# Altium schematic sheet PIC32.SchDoc
size A
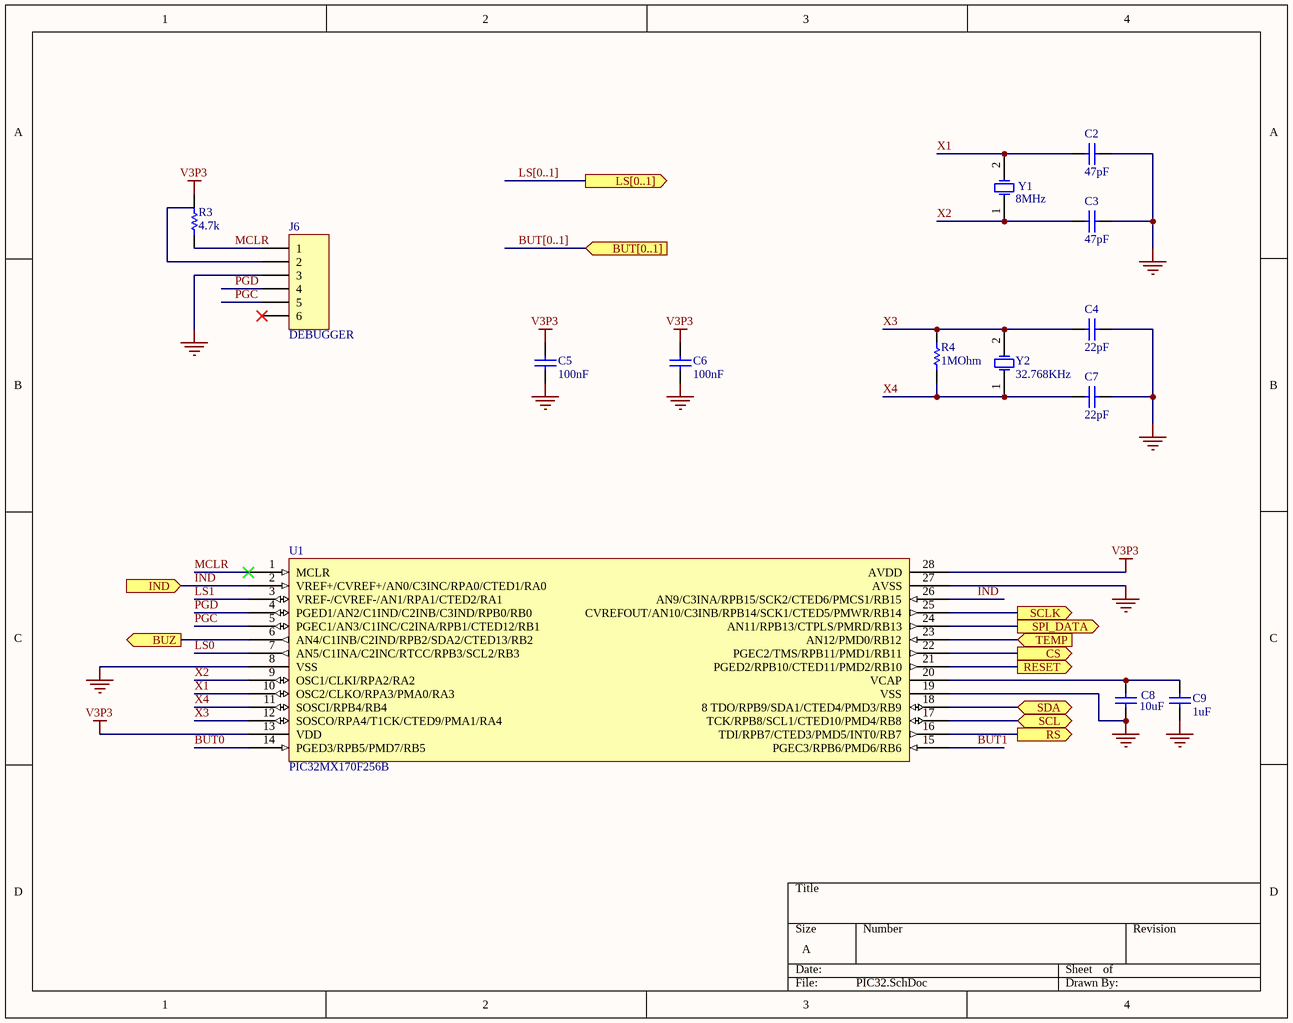
[diagram p0: PIC32.SchDoc]

## Parts
C2  47pF  [CAPACITOR]
C3  47pF  [CAPACITOR]
C4  22pF  [CAPACITOR]
C5  100nF  [CAPACITOR]
C6  100nF  [CAPACITOR]
C7  22pF  [CAPACITOR]
C8  10uF  [CAPACITOR]
C9  1uF  [CAPACITOR]
J6  DEBUGGER  [DEBUG]
R3  4.7k  [Resistor]
R4  1MOhm  [Resistor]
U1  PIC32MX170F256B  [PIC32]
Y1  8MHz  [OSC1]
Y2  32.768KHz  [OSC2]

## Ports
BUT[0..1] (in), BUZ (out), CS (out), IND (in), LS[0..1] (out), RESET (out), RS (out), SCL (bidir), SCLK (out), SDA (bidir), SPI_DATA (out), TEMP (in)

## Nets
GND: C2.2 C3.2 C4.2 C5.1 C6.1 C7.2 C8.1 C9.1 J6.3 U1.8(VSS) U1.19(VSS) U1.27(AVSS)
V3P3: C5.2 C6.2 R3.1 U1.13(VDD) U1.28(AVDD)
BUT0: U1.14(PGED3/RPB5/PMD7/RB5)
BUT1: U1.15(PGEC3/RPB6/PMD6/RB6)
BUZ: U1.6(AN4/C1INB/C2IND/RPB2/SDA2/CTED13/RB2) ; port BUZ
CS: U1.22(PGEC2/TMS/RPB11/PMD1/RB11) ; port CS
IND: U1.2(VREF+/CVREF+/AN0/C3INC/RPA0/CTED1/RA0) U1.26(AN9/C3INA/RPB15/SCK2/CTED6/PMCS1/RB15) ; port IND
LS0: U1.7(AN5/C1INA/C2INC/RTCC/RPB3/SCL2/RB3)
LS1: U1.3(VREF-/CVREF-/AN1/RPA1/CTED2/RA1)
MCLR: J6.1 R3.2 U1.1(MCLR)
PGC: J6.5 U1.5(PGEC1/AN3/C1INC/C2INA/RPB1/CTED12/RB1)
PGD: J6.4 U1.4(PGED1/AN2/C1IND/C2INB/C3IND/RPB0/RB0)
RESET: U1.21(PGED2/RPB10/CTED11/PMD2/RB10) ; port RESET
RS: U1.16(TDI/RPB7/CTED3/PMD5/INT0/RB7) ; port RS
SCL: U1.17(TCK/RPB8/SCL1/CTED10/PMD4/RB8) ; port SCL
SCLK: U1.25(CVREFOUT/AN10/C3INB/RPB14/SCK1/CTED5/PMWR/RB14) ; port SCLK
SDA: U1.18(8_TDO/RPB9/SDA1/CTED4/PMD3/RB9) ; port SDA
SPI_DATA: U1.24(AN11/RPB13/CTPLS/PMRD/RB13) ; port SPI_DATA
TEMP: U1.23(AN12/PMD0/RB12) ; port TEMP
X1: C2.1 U1.10(OSC2/CLKO/RPA3/PMA0/RA3) Y1.2(OSC2)
X2: C3.1 U1.9(OSC1/CLKI/RPA2/RA2) Y1.1(OSC1)
X3: C4.1 R4.1 U1.12(SOSCO/RPA4/T1CK/CTED9/PMA1/RA4) Y2.2(OSC2)
X4: C7.1 R4.2 U1.11(SOSCI/RPB4/RB4) Y2.1(OSC1)
NetC8_2: C8.2 C9.2 U1.20(VCAP)

Not connected (* = marked no-connect by the designer): J6 2 6*

## Buses and harness runs
bus BUT[0..1] = port BUT[0..1]
bus LS[0..1] = port LS[0..1]

## Library data of the parts
C2-C9 = Cap: Capacitor; Published: 8-Jun-2000; LatestRevisionDate: 17-Jul-2002; LatestRevisionNote: Re-released for DXP Platform.; PackageReference: RAD-0.3; Publisher: Altium Limited; PackageDescription: Radial Cap, Thru-Hole; 2 Leads; 0.3 in Pin Spacing
J6 = Header 6: DEB Connector; Ref. Fournisseur: 9731172; Fabricant: Molex; Fournisseur: Farnell; LatestRevisionDate: 17-Jul-2002; LatestRevisionNote: Re-released for DXP Platform.; Publisher: Altium Limited; Ref. Fabricant: 22-27-2061
R3 R4 = Res1: Resistor; Published: 8-Jun-2000; LatestRevisionDate: 17-Jul-2002; LatestRevisionNote: Re-released for DXP Platform.; PackageReference: AXIAL-0.3; Publisher: Altium Limited; PackageDescription: Axial Device, Thru-Hole; 2 Leads; 0.3 in Pin Spacing
  R3: Value: 4.7k
  R4: Value: 1MOhm
U1 = PIC32MX170F256B: PIC32; Fabricant: MICROCHIP; Ref. Fabricant: PIC32MX170F256B-I/SO; Fournisseur: Farnell; Ref. Fournisseur: 2449077
Y1 = XTAL: Crystal Oscillator; Fabricant: IQD FREQUENCY PRODUCTS; Fournisseur: Farnell; Ref. Fabricant: LFXTAL003156; Ref. Fournisseur: 9712844; Published: 8-Jun-2000; LatestRevisionDate: 17-Jul-2002; LatestRevisionNote: Re-released for DXP Platform.; PackageReference: R38; Publisher: Altium Limited; PackageDescription: Crystal, Thru-Hole; 2 Leads; Body 3.1 x 8.2 mm (Dia.xH)
Y2 = XTAL: Crystal Oscillator; Fabricant: RALTRON; Fournisseur: Farnell; Ref. Fabricant: R26-32.768- 12.5; Ref. Fournisseur: 1652573; Published: 8-Jun-2000; LatestRevisionDate: 17-Jul-2002; LatestRevisionNote: Re-released for DXP Platform.; PackageReference: R38; Publisher: Altium Limited; PackageDescription: Crystal, Thru-Hole; 2 Leads; Body 3.1 x 8.2 mm (Dia.xH)